# EAGLE design main (EAGLE 5.07)
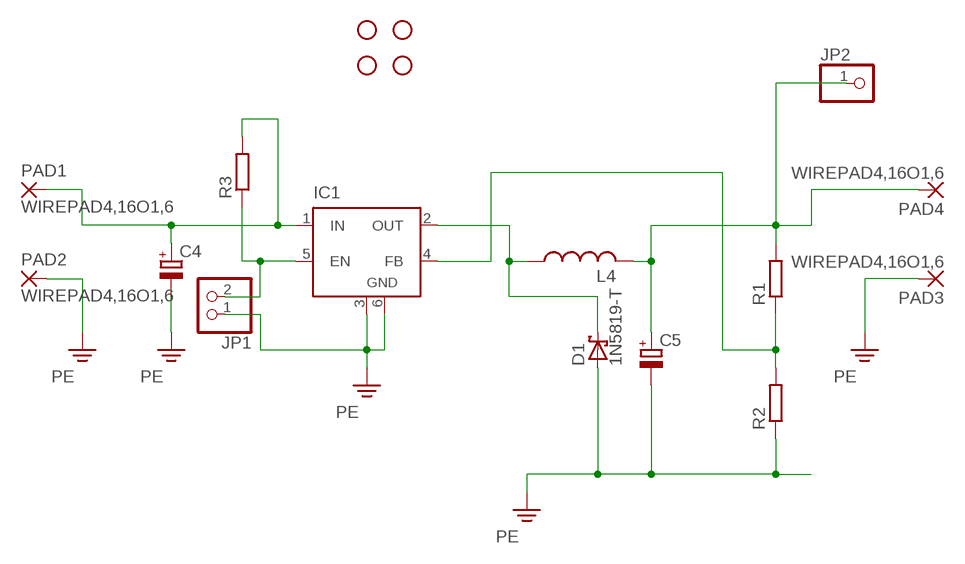
[diagram p0: schematic, sheet 1]

## Parts
C4  CPOL-EUE15-5AXIAL  [E15-5]
C5  CPOL-EUE25-9AXIAL  [E25-9]
D1  1N5819-T  [DO41-7.6]
IC1  LM2596S  [TO263-5]
JP1  PINHD-1X2  [1X02]
JP2  PINHD-1X1  [1X01]
JP3  STAND-OFF  [STAND-OFF]
JP4  STAND-OFF  [STAND-OFF]
JP5  STAND-OFF  [STAND-OFF]
JP6  STAND-OFF  [STAND-OFF]
L4  L-US0207/5V  [0207/5V]
PAD1  WIREPAD4,16O1,6  [4,16O1,6]
PAD2  WIREPAD4,16O1,6  [4,16O1,6]
PAD3  WIREPAD4,16O1,6  [4,16O1,6]
PAD4  WIREPAD4,16O1,6  [4,16O1,6]
R1  R-EU_R0603  [R0603]
R2  R-EU_R0603  [R0603]
R3  R-EU_R0603  [R0603]

## Nets
N$1: C4.+ IC1.1(IN) PAD1.1(P) R3.2
N$2: C5.+ JP2.1 L4.2 PAD4.1(P) R1.2
N$3: IC1.4(FB) R1.1 R2.2
N$4: D1.C IC1.2(OUT) L4.1
N$7: IC1.5(EN) JP1.2 R3.1
PE: C4.- C5.- D1.A IC1.3(GND) IC1.6(GND) JP1.1 PAD2.1(P) PAD3.1(P) R2.1

## Library data of the parts
C4 C5 = rcl:CPOL-EU: POLARIZED CAPACITOR, European symbol
D1 = diode:1N581*: 1.0A SCHOTTKY BARRIER RECTIFIER Source: http://www.diodes.com/datasheets/ds23001.pdf
IC1 = linear:LM2596S: STEP-DOWN VOLTAGE REGULATOR
JP1 = pinhead:PINHD-1X2: PIN HEADER
JP2 = pinhead:PINHD-1X1: PIN HEADER
JP3-JP6 = SparkFun:STAND-OFF: Stand Off This is the mechanical footprint for a #4 phillips button head screw. Use the keepout ring to avoid running the screw head into surrounding components. SKU : PRT-00447
L4 = rcl:L-US: INDUCTOR, American symbol
PAD1-PAD4 = wirepad:WIREPAD: Wire PAD connect wire on PCB
R1-R3 = rcl:R-EU_: RESISTOR, European symbol

## Board
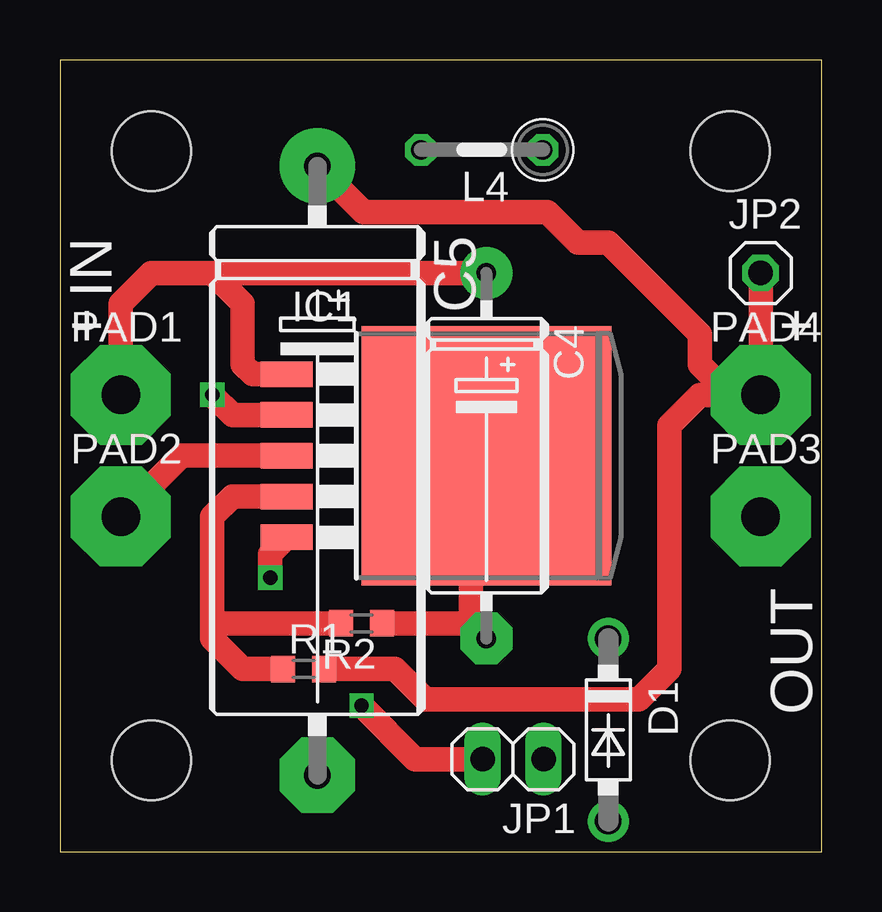
[diagram p1: board, top side]
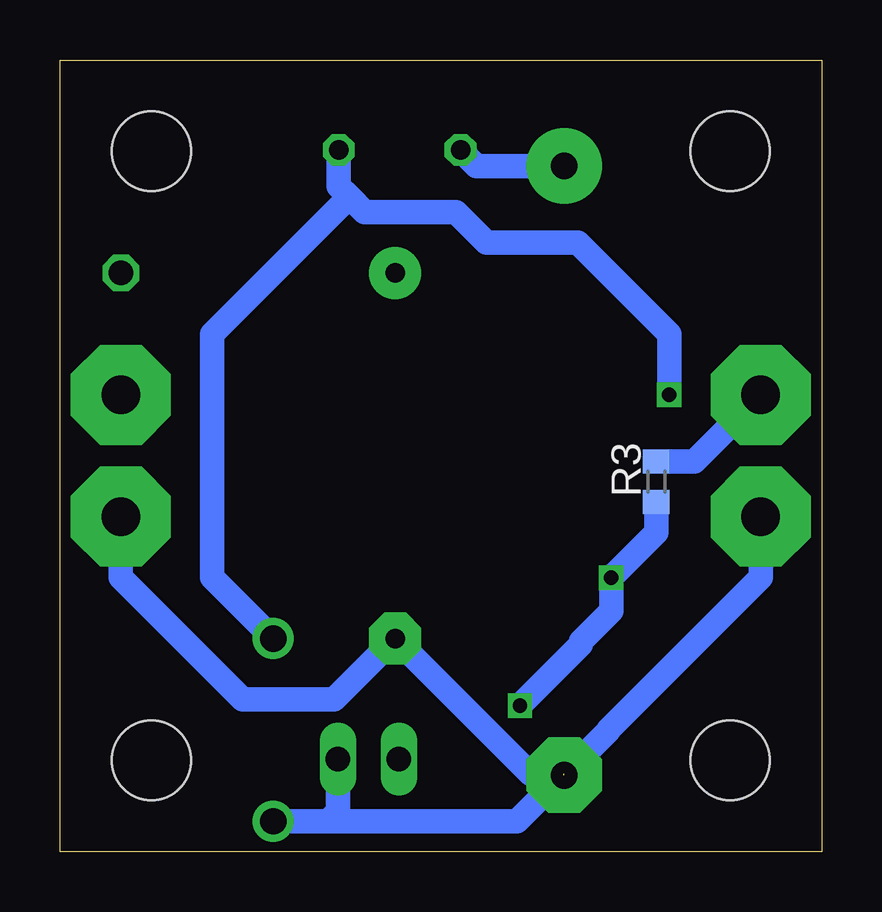
[diagram p2: board, bottom side, seen from below]

Size 31.75 x 33.01 mm. Coordinates in mm from the lower left corner, seen from the top.
Outline: 0,0 31.75,0 31.75,33.01 0,33.01 0,0
Copper layers (1*16): Top 0.035mm / dielectric 1.5mm / Bottom 0.035mm
Design rules "default": minimum track width 10mil, minimum drill 24mil, track to track 8mil, track to pad 8mil, pad to pad 8mil, via to via 8mil, smd to smd 8mil, copper to edge 40mil, drill to drill 8mil, minimum pad ring 10mil, minimum via ring 8mil, stop-mask expansion 4mil, vias tented up to drill 0mil, thermal gap 10mil

### Footprints (pad centres in the part's own frame; a part is rotated, then mirrored left to right if it is on the bottom)
E15-5 = drill 0.813 pad 2.159 round: + -7.62,0 | drill 0.813 pad 2.159 octagon: - 7.62,0
E25-9 = drill 1.118 pad 3.15 round: + -12.7,0 | drill 1.118 pad 3.15 octagon: - 12.7,0
DO41-7.6 = drill 1.1 pad 1.7 round: A 3.81,0; C -3.81,0
TO263-5 = smd 1.067 x 2.159: 1 -3.404,-5.791; 2 -1.702,-5.791; 3 0,-5.791; 4 1.702,-5.791; 5 3.404,-5.791 | smd 10.8 x 10.41: 6 0,2.54
1X02 = drill 1.016 long: 1 -1.27,0; 2 1.27,0
1X01 = drill 1.016 octagon: 1 0,0
STAND-OFF = hole 3.302: 0,0
0207/5V = drill 0.813 octagon: 1 -2.54,0; 2 2.54,0
4,16O1,6 = drill 1.6 pad 4.166 octagon: 1 0,0
R0603 = smd 1 x 1.1: 1 -0.85,0; 2 0.85,0

### Placement (x,y rotation side)
C4  17.78,16.51 270 top
C5  10.73,15.89 270 top
D1  22.86,5.08 270 top
IC1  15.24,16.51 270 top
JP1  18.89,3.86 180 top
JP2  29.21,24.13 0 top
JP3  3.81,29.21 0 top
JP4  27.94,29.21 0 top
JP5  27.94,3.81 0 top
JP6  3.81,3.81 0 top
L4  17.59,29.26 180 top
PAD1  2.54,19.05 0 top
PAD2  2.54,13.97 0 top
PAD3  29.21,13.97 0 top
PAD4  29.21,19.05 0 top
R1  10.16,7.62 0 top
R2  12.57,9.53 180 top
R3  6.89,15.43 90 bottom

### Tracks (layer width: path | path; a pad name or v marks a point on that pad's centre or on a via)
N$1
  Top 1.016: IC1.1 8.03,19.91 7.62,20.32 7.62,22.86 6.35,24.13 | 6.35,24.13 3.81,24.13 2.54,22.86 PAD1.1 | 6.35,24.13 C4.+
  Bottom 1.016: R3.2 5.31,16.28 PAD1.1
N$2
  Top 1.016: PAD4.1 27.94,19.05 26.67,20.32 26.67,21.59 22.86,25.4 21.59,25.4 20.32,26.67 12.65,26.67 C5.+ | R1.2 13.97,7.62 15.24,6.35 24.13,6.35 25.4,7.62 25.4,17.78 26.67,19.05 PAD4.1 | PAD4.1 JP2.1
  Bottom 1.016: C5.+ 14.38,28.59 L4.2
N$3
  Top 1.016: IC1.4 7.19,14.81 6.35,13.97 6.35,9.27 | R1.1 7.62,7.62 6.35,8.89 6.35,9.27 | R2.2 6.6,9.53 6.35,9.27
N$4  (via drill 0.6 pad 1.02)
  Top 1.016: IC1.2 7.19,18.21 v6.35,19.05
  Bottom 1.016: L4.1 20.13,27.75 19.68,27.3 | 19.68,27.3 19.05,26.67 15.24,26.67 13.97,25.4 10.16,25.4 6.35,21.59 v6.35,19.05 | D1.C 25.4,11.43 25.4,21.59 19.68,27.3
N$7  (via drill 0.6 pad 1.02)
  Top 1.016: JP1.2 14.81,3.86 v12.57,6.1 | v8.76,11.43 8.76,12.42 IC1.5
  Bottom 1.016: v12.57,6.1 10.03,8.64 10.03,8.76 8.76,10.03 v8.76,11.43 6.89,13.3 R3.1
PE  (1 unrouted)
  Top 1.016: IC1.3 5.08,16.51 PAD2.1 | 17.14,9.53 R2.1 | C4.- 17.14,9.53 | 17.14,9.53 17.14,15.88 IC1.6
  Bottom 1.016: PAD2.1 2.54,11.43 8.89,5.08 8.89,5.03 C5.- 11.38,2.54 11.43,2.54 12.7,1.27 20.57,1.27 | 10.73,3.24 12.13,3.24 C4.- 20.32,6.35 24.13,6.35 29.21,11.43 PAD3.1 | 20.57,1.27 D1.A | JP1.1 20.16,1.68 20.57,1.27

### Text on the board
tPlace: IN | + | + | OUT